# EAGLE design Launch_Tower_Power_Interface_Board_v1-3 (EAGLE 6.2)
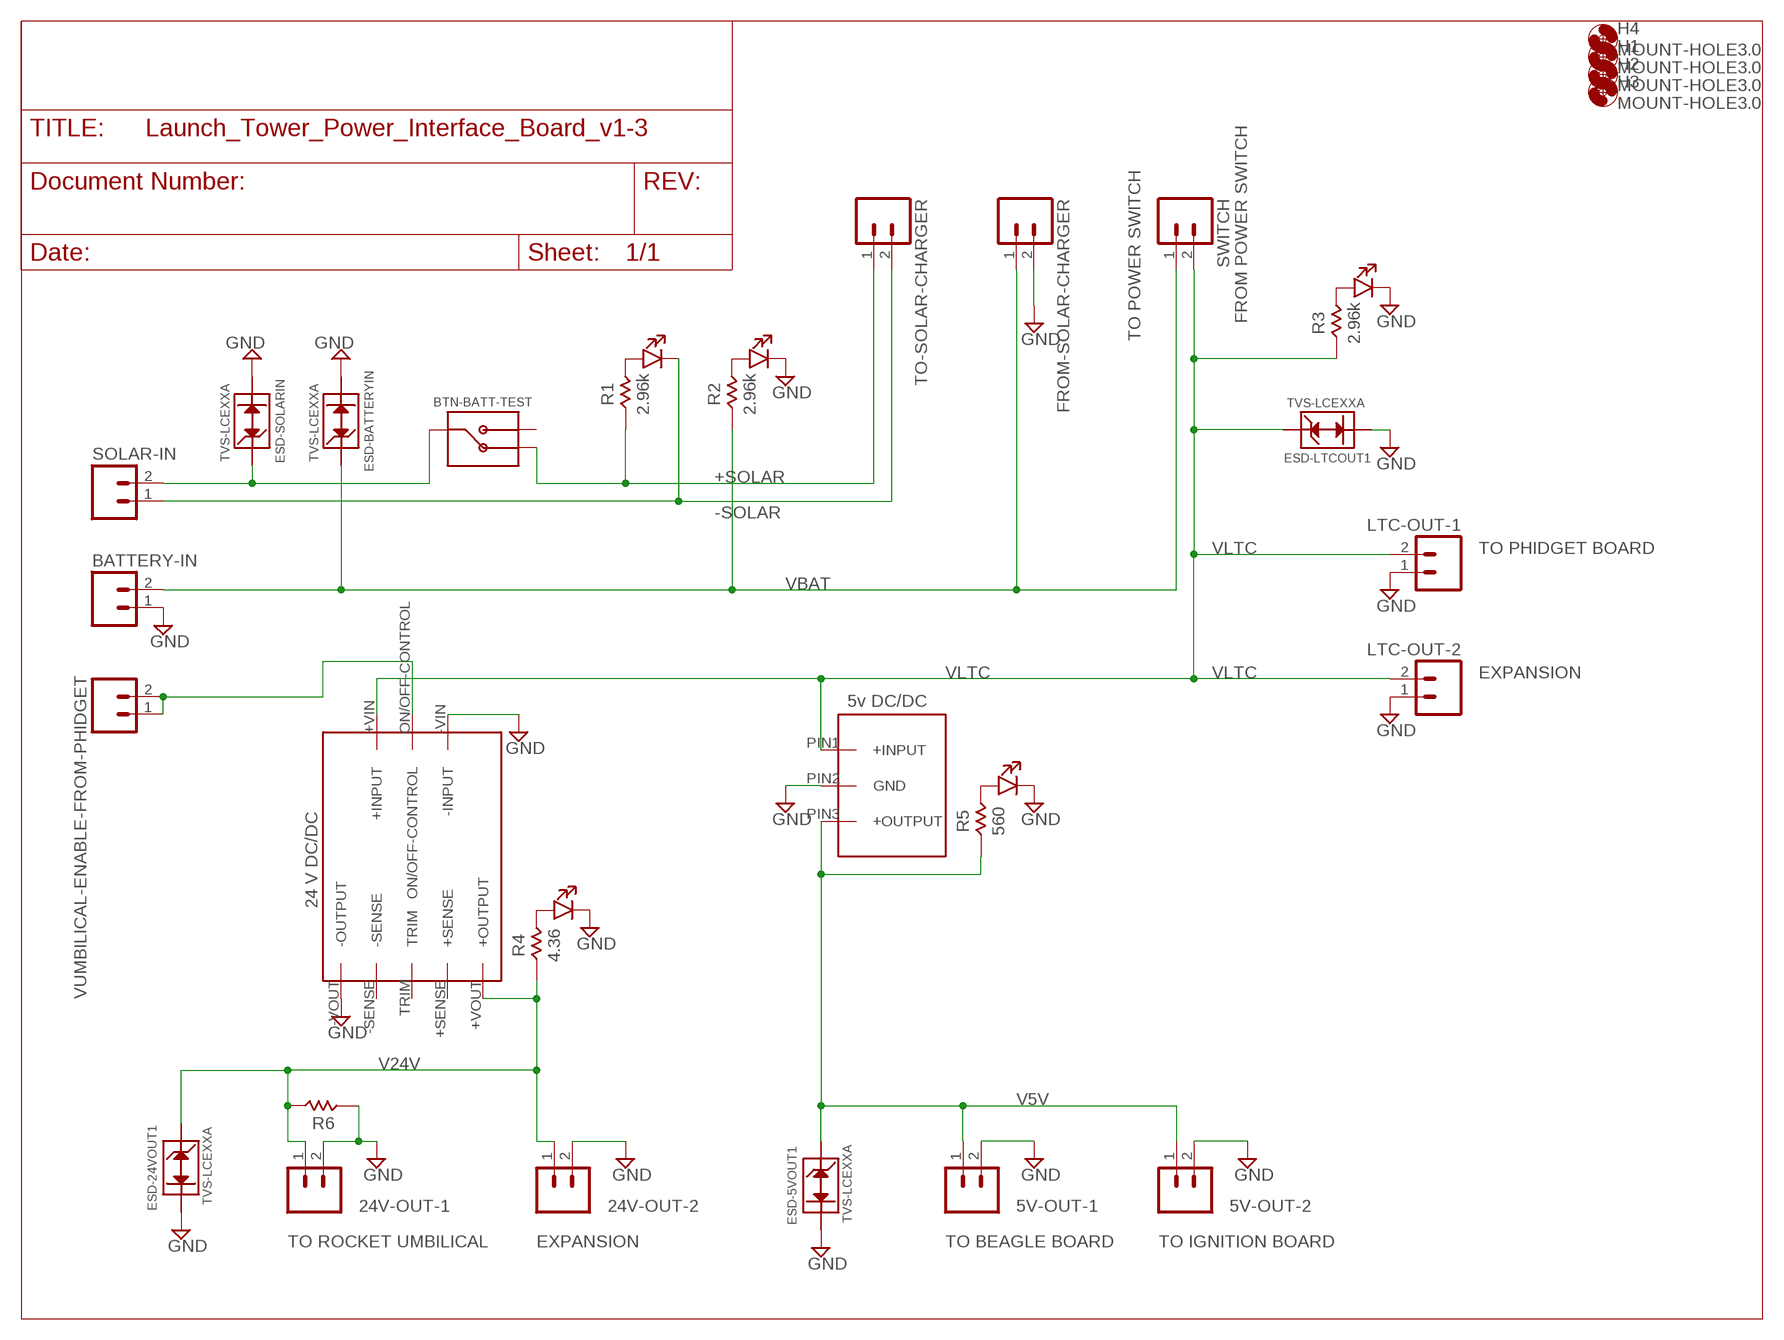
[diagram p0: schematic, sheet 1]

## Parts
5V-OUT-1  M025MM  [SCREWTERMINAL-5MM-2]
5V-OUT-2  M025MM  [SCREWTERMINAL-5MM-2]
24V-OUT-1  M025MM  [SCREWTERMINAL-5MM-2]
24V-OUT-2  M025MM  [SCREWTERMINAL-5MM-2]
BATTERY-IN  M025MM  [SCREWTERMINAL-5MM-2]
BTN-BATT-TEST  BUTTON-107-3006-EVX  [BUTTON-1]
ESD-5VOUT1  TVS-LCEXXA  [D0-201]
ESD-24VOUT1  TVS-LCEXXA  [D0-201]
ESD-BATTERYIN  TVS-LCEXXA  [D0-201]
ESD-LTCOUT1  TVS-LCEXXA  [D0-201]
ESD-SOLARIN  TVS-LCEXXA  [D0-201]
FROM-SOLAR-CHARGER  M025MM  [SCREWTERMINAL-5MM-2]
H1  MOUNT-HOLE3.0  [3,0]
H2  MOUNT-HOLE3.0  [3,0]
H3  MOUNT-HOLE3.0  [3,0]
H4  MOUNT-HOLE3.0  [3,0]
LED-5V-DC/DC  LED-550-XX04  [LED-550]
LED-24V-DC/DC  LED-550-XX04  [LED-550]
LED-BATTERY-IN  LED-550-XX04  [LED-550]
LED-SOLAR-IN  LED-550-XX04  [LED-550]
LED-SWITCH-IN  LED-550-XX04  [LED-550]
LTC-OUT-1  M025MM  [SCREWTERMINAL-5MM-2]
LTC-OUT-2  M025MM  [SCREWTERMINAL-5MM-2]
R1  2.96k  RESISTOR-0805  [0805]
R2  2.96k  RESISTOR-0805  [0805]
R3  2.96k  RESISTOR-0805  [0805]
R4  4.36  RESISTOR-0805  [0805]
R5  560  RESISTOR-0805  [0805]
R6  RESISTOR-0805  [0805]
SOLAR-IN  M025MM  [SCREWTERMINAL-5MM-2]
SWITCH  M025MM  [SCREWTERMINAL-5MM-2]
TO-SOLAR-CHARGER  M025MM  [SCREWTERMINAL-5MM-2]
U$1  DC/DC_CONV_24V  [UWE]
U$2  DC/DC_CONV_5V  [OKI-SIP]
VUMBILICAL-ENABLE-FROM-PHIDGET  M023.5MM  [SCREWTERMINAL-3.5MM-2]

## Nets
+SOLAR: BTN-BATT-TEST.NC R1.ANODE TO-SOLAR-CHARGER.1
-SOLAR: LED-SOLAR-IN.CATHODE SOLAR-IN.1 TO-SOLAR-CHARGER.2
GND: 5V-OUT-1.2 5V-OUT-2.2 24V-OUT-1.2 24V-OUT-2.2 BATTERY-IN.1 ESD-5VOUT1.CATHODE ESD-24VOUT1.CATHODE ESD-BATTERYIN.CATHODE ESD-LTCOUT1.CATHODE ESD-SOLARIN.CATHODE FROM-SOLAR-CHARGER.2 LED-5V-DC/DC.CATHODE LED-24V-DC/DC.CATHODE LED-BATTERY-IN.CATHODE LED-SWITCH-IN.CATHODE LTC-OUT-1.1 LTC-OUT-2.1 R6.ANODE U$1.-VIN(-INPUT) U$1.-VOUT(-OUTPUT) U$2.PIN2(GND)
GPIO: U$1.ON/OFF-CONTROL VUMBILICAL-ENABLE-FROM-PHIDGET.1 VUMBILICAL-ENABLE-FROM-PHIDGET.2
N$1: LED-SOLAR-IN.ANODE R1.CATHODE
N$2: LED-BATTERY-IN.ANODE R2.CATHODE
N$3: LED-SWITCH-IN.ANODE R3.CATHODE
N$4: LED-5V-DC/DC.ANODE R5.CATHODE
N$5: LED-24V-DC/DC.ANODE R4.CATHODE
N$6: BTN-BATT-TEST.COMMON ESD-SOLARIN.ANODE SOLAR-IN.2
V5V: 5V-OUT-1.1 5V-OUT-2.1 ESD-5VOUT1.ANODE R5.ANODE U$2.PIN3(+OUTPUT)
V24V: 24V-OUT-1.1 24V-OUT-2.1 ESD-24VOUT1.ANODE R4.ANODE R6.CATHODE U$1.+VOUT(+OUTPUT)
VBAT: BATTERY-IN.2 ESD-BATTERYIN.ANODE FROM-SOLAR-CHARGER.1 R2.ANODE SWITCH.1
VLTC: ESD-LTCOUT1.ANODE LTC-OUT-1.2 LTC-OUT-2.2 R3.ANODE SWITCH.2 U$1.+VIN(+INPUT) U$2.PIN1(+INPUT)
Unconnected: BTN-BATT-TEST.NO U$1.+SENSE U$1.-SENSE U$1.TRIM

## Notes on the sheet
- FROM POWER SWITCH
- TO POWER SWITCH
- TO PHIDGET BOARD
- EXPANSION
- 5v DC/DC
- 24 V DC/DC
- TO ROCKET UMBILICAL | EXPANSION | TO BEAGLE BOARD | TO IGNITION BOARD

## Library data of the parts
5V-OUT-1 5V-OUT-2 24V-OUT-1 24V-OUT-2 BATTERY-IN FROM-SOLAR-CHARGER LTC-OUT-1 LTC-OUT-2 SOLAR-IN SWITCH TO-SOLAR-CHARGER = SparkFun:M02: Header 2 Standard 2-pin 0.1" header. Use with straight break away headers (SKU : PRT-00116), right angle break away headers (PRT-00553), swiss pins (PRT-00743), machine pins (PRT-00117), and female headers (PRT-00115). Molex polarized connector foot print use with SKU : PRT-08233 with associated crimp pins and housings.
BTN-BATT-TEST = launch-tower:BUTTON-107-3006-EVX
ESD-5VOUT1 ESD-24VOUT1 ESD-BATTERYIN ESD-LTCOUT1 ESD-SOLARIN = launch-tower:TVS-LCEXXA
H1-H4 = holes:MOUNT-HOLE: MOUNTING HOLE with drill center marker
LED-5V-DC/DC LED-24V-DC/DC LED-BATTERY-IN LED-SOLAR-IN LED-SWITCH-IN = launch-tower:LED-550-XX04
R1-R6 = launch-tower:RESISTOR-0805
U$1 = launch-tower:DC/DC_CONV_24V
U$2 = launch-tower:DC/DC_CONV_5V
VUMBILICAL-ENABLE-FROM-PHIDGET = SparkFun-Connectors:M02: Header 2 Standard 2-pin 0.1" header. Use with straight break away headers (SKU : PRT-00116), right angle break away headers (PRT-00553), swiss pins (PRT-00743), machine pins (PRT-00117), and female headers (PRT-00115). Molex polarized connector foot print use with SKU : PRT-08233 with associated crimp pins and housings.

## Board
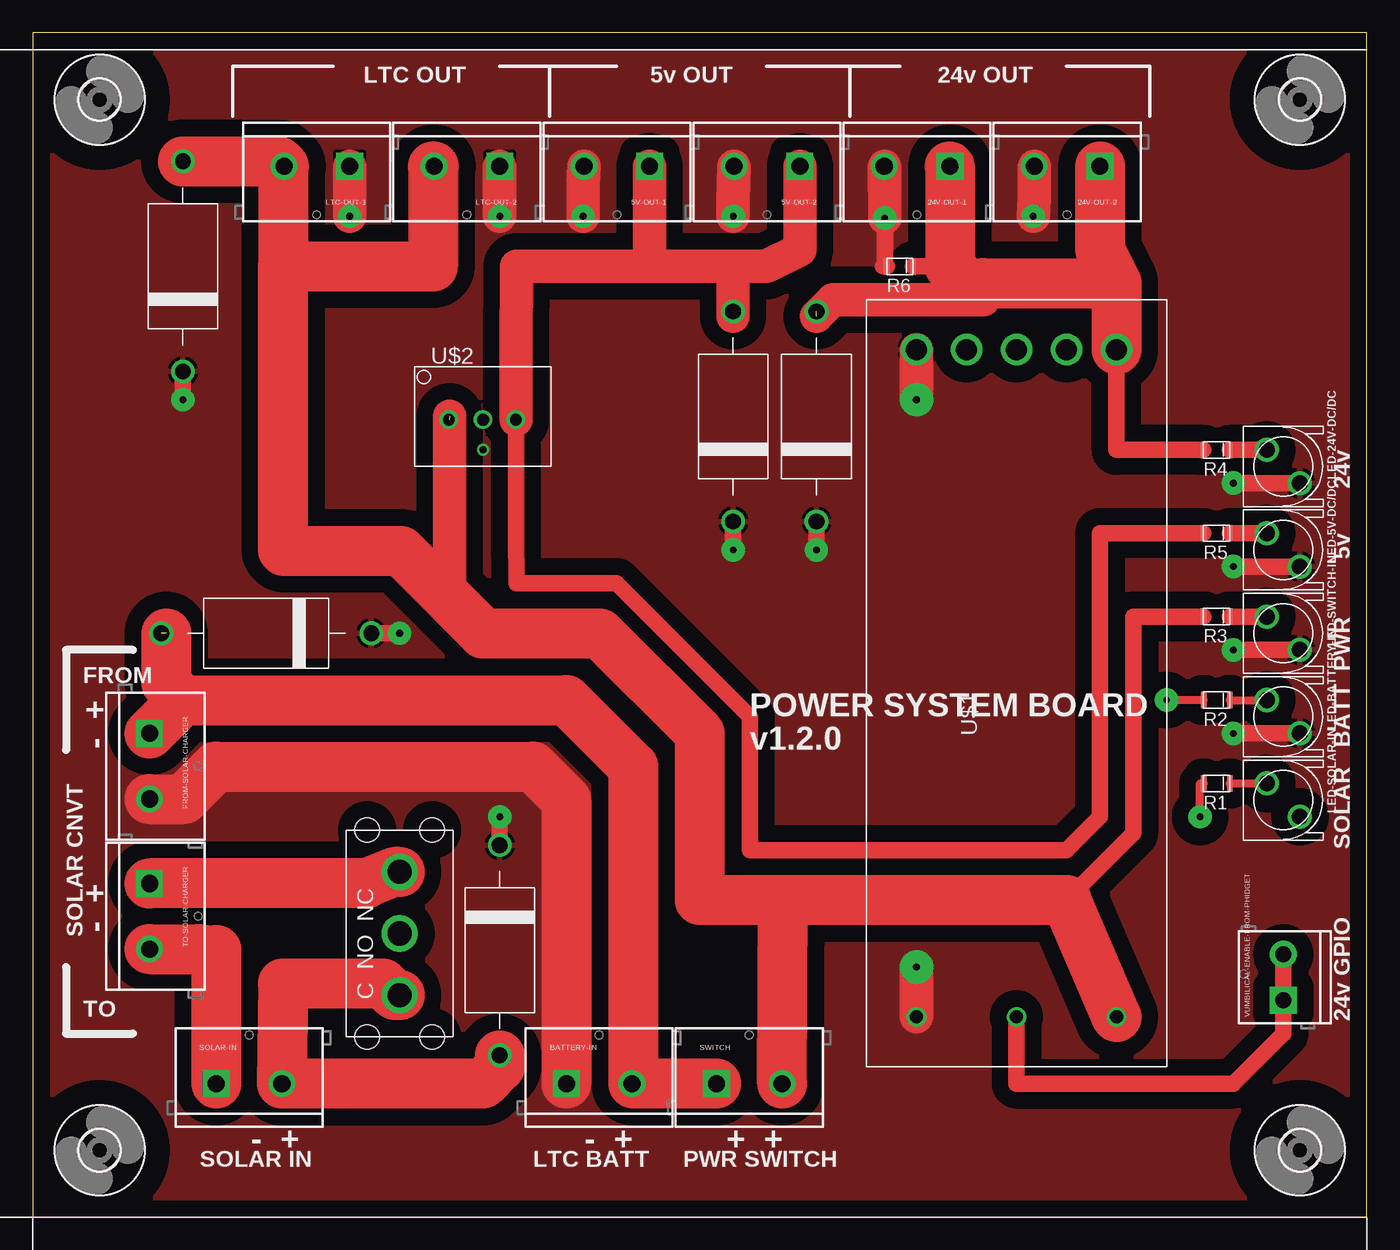
[diagram p1: board, top side]
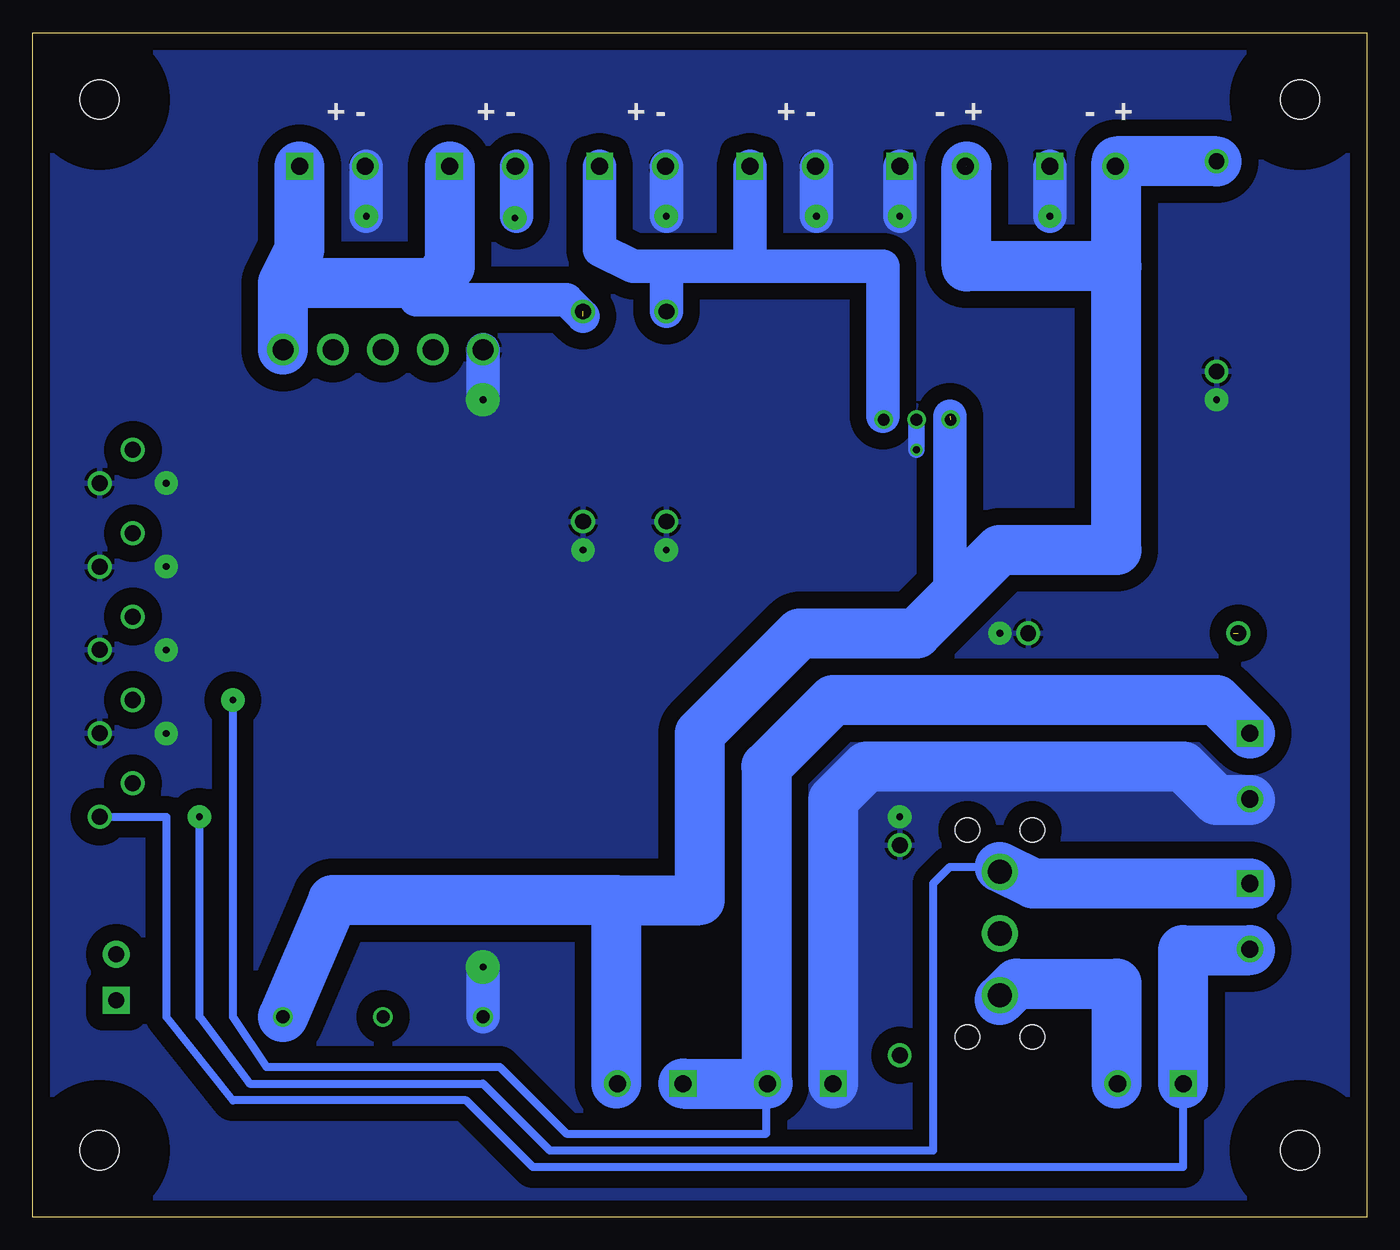
[diagram p2: board, bottom side, seen from below]

Size 101.6 x 90.17 mm. Coordinates in mm from the lower left corner, seen from the top.
Outline: 0,0 101.6,0 101.6,90.17 0,90.17 0,0
Copper layers (1*16): Top 0.035mm / dielectric 1.5mm / Bottom 0.035mm
Design rules: minimum track width 10mil, minimum drill 24mil, track to track 8mil, track to pad 8mil, pad to pad 8mil, via to via 8mil, smd to smd 8mil, copper to edge 40mil, drill to drill 8mil, minimum pad ring 10mil, minimum via ring 8mil, stop-mask expansion 4mil, vias tented up to drill 0mil, thermal gap 10mil

### Footprints (pad centres in the part's own frame; a part is rotated, then mirrored left to right if it is on the bottom)
SCREWTERMINAL-5MM-2 = drill 1.3 pad 2.032 square: 1 0,0 | drill 1.3 pad 2.032: 2 5,0
BUTTON-1 = drill 1.85: COMMON -4.7,0; NC 4.7,0; NO 0,0 | hole 1.85: -7.875,2.476; -7.875,-2.475; 7.875,2.475; 7.875,-2.475
D0-201 = drill 1.2: ANODE -8,0; CATHODE 8,0
3,0 = hole 3: 0,0
LED-550 = drill 1.22: ANODE 1.27,1.27; CATHODE -1.27,-1.27
0805 = smd 0.4 x 1.25: ANODE -1,0; CATHODE 1,0
UWE = drill 1.6: +SENSE 25.4,-3.81; +VOUT 25.4,-7.62; -SENSE 25.4,3.81; -VOUT 25.4,7.62; TRIM 25.4,0 | drill 1: +VIN -25.4,-7.62; -VIN -25.4,7.62; ON/OFF-CONTROL -25.4,0
OKI-SIP = drill 0.9 pad 0.813: PIN1 -2.6,-0.25; PIN2 0,-0.25; PIN3 2.5,-0.25
SCREWTERMINAL-3.5MM-2 = drill 1.2 pad 2.032 square: 1 0,0 | drill 1.2 pad 2.032: 2 3.5,0

### Placement (x,y rotation side)
5V-OUT-1  46.99,80.01 180 top
5V-OUT-2  58.42,80.01 180 top
24V-OUT-1  69.85,80.01 180 top
24V-OUT-2  81.28,80.01 180 top
BATTERY-IN  40.64,10.16 0 top
BTN-BATT-TEST  27.94,21.59 90 top
ESD-5VOUT1  53.34,60.96 270 top
ESD-24VOUT1  59.69,60.96 270 top
ESD-BATTERYIN  17.78,44.45 0 top
ESD-LTCOUT1  11.43,72.39 270 top
ESD-SOLARIN  35.56,20.32 90 top
FROM-SOLAR-CHARGER  8.89,36.83 270 top
H1  5.08,85.09 0 top
H2  5.08,5.08 0 top
H3  96.52,5.08 0 top
H4  96.52,85.09 0 top
LED-5V-DC/DC  95.25,50.8 90 top
LED-24V-DC/DC  95.25,57.15 90 top
LED-BATTERY-IN  95.25,38.1 90 top
LED-SOLAR-IN  95.25,31.75 90 top
LED-SWITCH-IN  95.25,44.45 90 top
LTC-OUT-1  24.13,80.01 180 top
LTC-OUT-2  35.56,80.01 180 top
R1  90.17,33.02 0 top
R2  90.17,39.37 0 top
R3  90.17,45.72 0 top
R4  90.17,58.42 0 top
R5  90.17,52.07 0 top
R6  66.04,72.39 0 top
SOLAR-IN  13.97,10.16 0 top
SWITCH  52.07,10.16 0 top
TO-SOLAR-CHARGER  8.89,25.4 270 top
U$1  74.93,40.64 90 top
U$2  34.29,60.96 0 top
VUMBILICAL-ENABLE-FROM-PHIDGET  95.25,16.51 90 top

### Tracks (layer width: path | path; a pad name or v marks a point on that pad's centre or on a via)
+SOLAR  (via drill 0.51 pad 1.78)
  Top 0.61: v88.9,30.48 88.9,33.02 R1.ANODE
  Top 3.81: BTN-BATT-TEST.NC 27.56,26.29 25.4,25.4 TO-SOLAR-CHARGER.1
  Bottom 0.61: v88.9,30.48 88.9,15.24 85.09,10.16 67.31,10.16 62.23,5.08 33.02,5.08 33.02,25.4 31.75,26.67 28.32,26.67
  Bottom 1.27: 28.32,26.67 BTN-BATT-TEST.NC
  Bottom 3.81: 27.94,26.67 25.4,25.4 TO-SOLAR-CHARGER.1
-SOLAR
  Top 3.81: TO-SOLAR-CHARGER.2 12.62,20.4 13.97,20.32 SOLAR-IN.1
  Bottom 0.61: SOLAR-IN.1 13.97,3.81 63.5,3.81 68.58,8.89 86.36,8.89 91.44,15.24 91.44,30.48 LED-SOLAR-IN.CATHODE
  Bottom 3.81: SOLAR-IN.1 13.97,20.32 8.89,20.32
GND  (via drill 0.51, 0.51 pad 1.78, 0.51 pad 2.54)
  Top 1.27: ESD-LTCOUT1.CATHODE v11.43,62.23 | ESD-5VOUT1.CATHODE v53.34,50.8 | ESD-BATTERYIN.CATHODE v27.94,44.45 | ESD-SOLARIN.CATHODE v35.56,30.48 | v59.69,50.8 ESD-24VOUT1.CATHODE | R6.ANODE 64.77,72.39 64.9,72.52 v64.9,76.07 | v91.44,36.83 LED-BATTERY-IN.CATHODE | LED-SWITCH-IN.CATHODE v91.44,43.18 | v91.44,49.53 LED-5V-DC/DC.CATHODE | v91.44,55.88 LED-24V-DC/DC.CATHODE
  Top 2.54: LTC-OUT-1.1 v24.13,76.2 | LTC-OUT-2.1 v35.56,76.2 | v41.91,76.2 41.91,78.66 5V-OUT-1.2 | v53.34,76.2 53.34,77.39 5V-OUT-2.2 | 24V-OUT-1.2 v64.9,76.07 | U$1.-VOUT v67.31,62.23 | U$1.-VIN v67.31,19.05 | 24V-OUT-2.2 76.28,77.55 v76.2,76.2
  Top 3.81: FROM-SOLAR-CHARGER.2 11.51,31.83 13.97,34.29 38.1,34.29 40.64,31.75 BATTERY-IN.1
  Bottom 1.27: U$2.PIN2 v34.29,58.42
  Bottom 2.54: LTC-OUT-1.1 v24.13,76.2 | LTC-OUT-2.1 v35.56,76.2 | 41.91,80.01 v41.91,76.2 | 53.34,80.01 v53.34,76.2 | 76.2,80.01 v76.2,76.2 | U$1.-VOUT v67.31,62.23 | v67.31,19.05 U$1.-VIN
  Bottom 3.81: 8.89,31.75 11.43,31.75 13.97,34.29 38.1,34.29 40.64,31.75 BATTERY-IN.1
  pour Bottom (isolate 1.27): 1.27,88.9 100.33,88.9 100.33,1.27 1.27,1.27
  pour Top (isolate 1.27): 1.27,88.9 100.33,88.9 100.33,1.27 1.27,1.27
GPIO
  Top 1.27: VUMBILICAL-ENABLE-FROM-PHIDGET.2 VUMBILICAL-ENABLE-FROM-PHIDGET.1 95.25,13.97 91.44,10.16 74.93,10.16 U$1.ON/OFF-CONTROL
N$1
  Top 0.61: R1.CATHODE LED-SOLAR-IN.ANODE
N$2
  Top 0.61: R2.CATHODE LED-BATTERY-IN.ANODE
N$3
  Top 1.27: LED-SWITCH-IN.ANODE R3.CATHODE
N$4
  Top 1.27: LED-5V-DC/DC.ANODE R5.CATHODE
N$5
  Top 1.27: LED-24V-DC/DC.ANODE R4.CATHODE
N$6
  Top 3.81: BTN-BATT-TEST.COMMON 27.56,16.89 26.67,17.78 19.05,17.78 SOLAR-IN.2 34.29,10.16 35.56,11.43 ESD-SOLARIN.ANODE
N$7
  Bottom 3.81: 27.94,16.51 26.67,17.78 19.05,17.78 19.05,10.16
N$9
  Bottom 2.54: 64.77,80.01 64.77,76.2
N$10
  Bottom 2.54: 59.69,68.58 60.96,69.85 72.39,69.85
V5V
  Top 1.27: R5.ANODE 81.28,52.07 81.28,30.48 78.74,27.94 54.61,27.94 54.61,38.1 44.45,48.26 36.83,48.26 36.79,52.11 U$2.PIN3
  Top 2.54: U$2.PIN3 36.79,66 36.83,72.39 46.99,72.39 | 46.99,72.39 53.34,72.39 | 53.34,72.39 55.88,72.39 58.42,73.66 5V-OUT-2.1 | 5V-OUT-1.1 46.99,72.39 | 53.34,68.58 53.34,72.39
  Bottom 2.54: 36.83,60.96 36.83,72.39 46.99,72.39 | 46.99,72.39 5V-OUT-1.1 | 46.99,72.39 53.34,72.39 | 53.34,72.39 55.88,72.39 58.42,73.66 5V-OUT-2.1 | ESD-5VOUT1.ANODE 53.34,72.39
V24V  (1 unrouted)
  Top 1.27: R6.CATHODE 69.85,72.39 | 72.39,69.85 72.39,71.12 | R4.ANODE 82.55,58.42 U$1.+VOUT
  Top 2.54: 59.69,68.58 60.96,69.85 72.39,69.85
  Top 3.81: 24V-OUT-2.1 81.28,73.66 82.55,71.12 | 82.55,71.12 U$1.+VOUT | 24V-OUT-1.1 69.85,72.39 71.12,71.12 72.39,71.12 82.55,71.12
  Bottom 3.81: U$1.+VOUT 82.55,71.12 | 82.55,71.12 81.28,73.66 24V-OUT-2.1 | 24V-OUT-1.1 69.85,72.39 71.12,71.12 82.55,71.12
VBAT  (via drill 0.51 pad 1.78)  (1 unrouted)
  Top 0.61: R2.ANODE v86.36,39.37
  Top 1.27: v45.72,10.08 BATTERY-IN.2
  Top 3.81: SWITCH.1 45.72,10.16 45.72,34.29 40.64,39.37 11.43,39.37 | FROM-SOLAR-CHARGER.1 11.43,39.37 | 10.16,44.45 10.16,40.64 11.43,39.37
  Bottom 0.61: v86.36,39.37 86.36,15.24 83.82,11.43 66.04,11.43 60.96,6.35 45.72,6.35 v45.72,10.08
  Bottom 3.81: SWITCH.1 45.72,10.16 | 45.72,10.16 BATTERY-IN.2 | FROM-SOLAR-CHARGER.1 11.43,39.37 40.64,39.37 45.72,34.29 45.72,10.16
VLTC  (2 unrouted)
  Top 1.27: R3.ANODE 83.82,45.72 83.82,29.21 78.74,24.13
  Top 2.54: 31.75,60.96 31.75,46.99
  Top 3.81: SWITCH.2 57.15,24.13 | 57.15,24.13 50.8,24.13 50.8,36.83 43.18,44.45 34.29,44.45 31.75,46.99 28.02,50.72 19.13,50.72 | 19.05,72.39 19.05,80.01 LTC-OUT-1.2 18.75,80.39 ESD-LTCOUT1.ANODE | 19.05,72.39 30.48,72.39 30.48,80.01 LTC-OUT-2.2 | 19.05,50.8 19.05,72.39 | U$1.+VIN 78.74,24.13 57.15,24.13
  Bottom 2.54: 31.75,60.96 31.75,46.99
  Bottom 3.81: 57.15,10.16 57.15,24.13 | 57.15,24.13 78.74,24.13 U$1.+VIN | 57.15,24.13 50.8,24.13 50.8,36.83 43.18,44.45 34.29,44.45 31.75,46.99 27.94,50.8 19.05,50.8 19.05,72.39 | 19.05,72.39 19.05,80.39 ESD-LTCOUT1.ANODE | 19.05,72.39 30.48,72.39 30.48,80.01

### Text on the board
tPlace: LTC OUT | 5v OUT | 24v OUT | 24v | 5v | PWR | FROM | BATT | - + | SOLAR | SOLAR CNVT | - + | 24v GPIO | TO | + - | + - | + + | SOLAR IN | LTC BATT | PWR SWITCH
bPlace: - + | - + | + - | + - | + - | + -
tNames: POWER SYSTEM BOARD | v1.2.0